# Altium schematic sheet Sheet1.SchDoc
size A; SheetNumber: 1; SheetTotal: 1
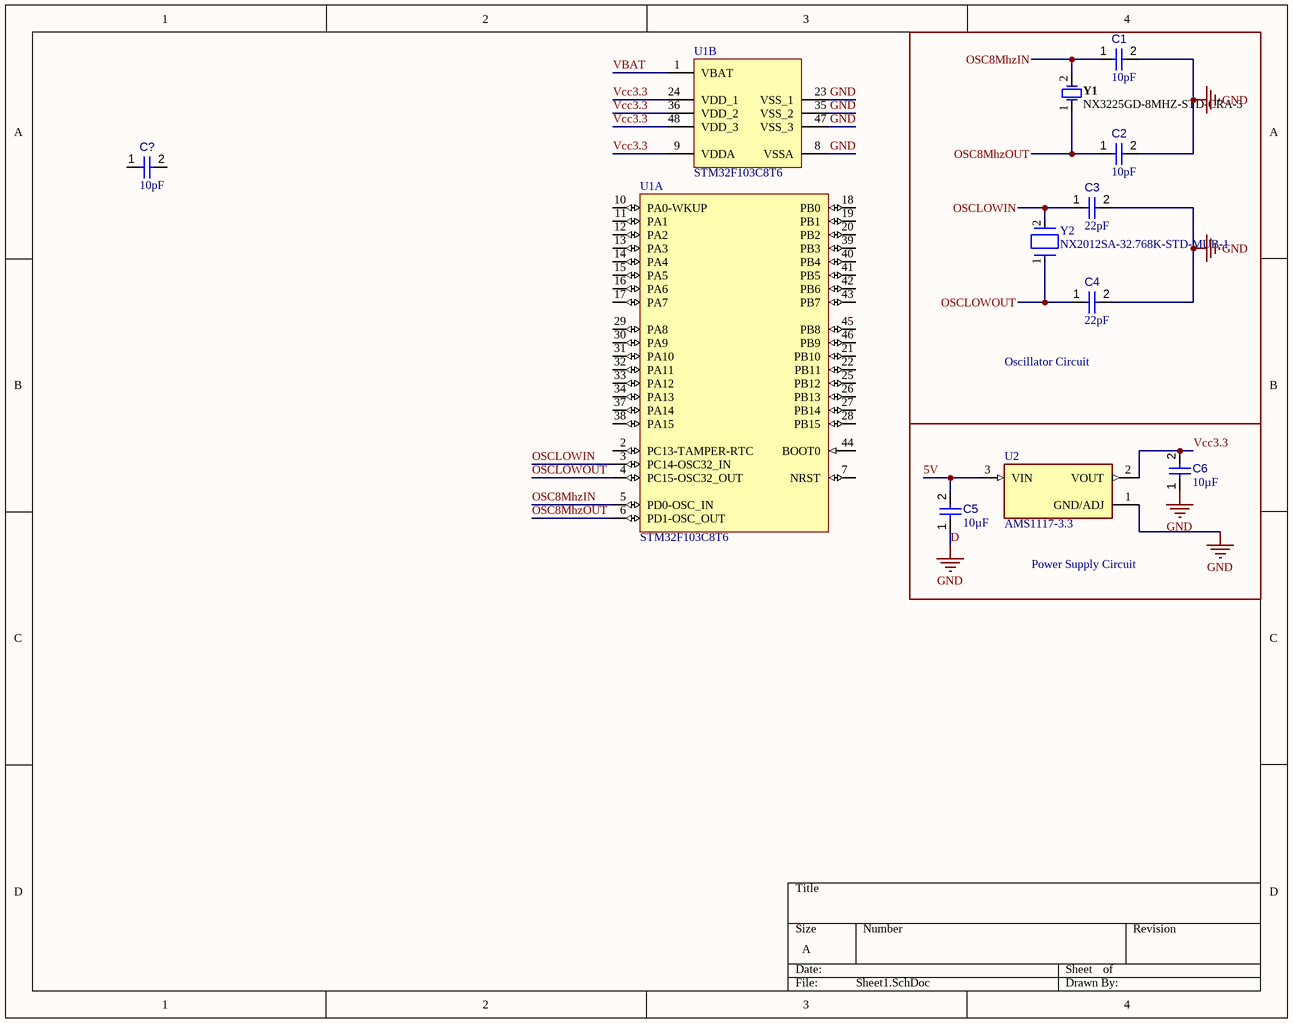
[diagram p0: Sheet1.SchDoc]

## Parts
C1  value 10pF  [CAPC1608X87X35NL15T15]  (hidden comment: Capacitor 10 pF +/- 0.25 pF 50 V 0603)
C2  value 10pF  [CAPC1608X87X35NL15T15]  (hidden comment: Capacitor 10 pF +/- 0.25 pF 50 V 0603)
C3  value 22pF  [CAPC0402(1005)60_L]  (hidden comment: Capacitor 22pF +/-10% 50V 0402)
C4  value 22pF  [CAPC0402(1005)60_L]  (hidden comment: Capacitor 22pF +/-10% 50V 0402)
C5  value 10µF  [CAPC0805(2012)145_L]  (hidden comment: Capacitor 10µF +/-20% 25V 0805)
C6  value 10µF  [CAPC0805(2012)145_L]  (hidden comment: Capacitor 10µF +/-20% 25V 0805)
C?  value 10pF  [CAPC1608X87X35NL15T15]  (hidden comment: Capacitor 10 pF +/- 0.25 pF 50 V 0603)
U1  STM32F103C8T6  [STM-LQFP48_L]  (parts A,B of 2)
U2  AMS1117-3.3  [SOT229P700X180-4N]
Y1  NX3225GD-8MHZ-STD-CRA-3  [NDK-NX3225GD-8MHZ-STD-CRA-3_V]
Y2  NX2012SA-32.768K-STD-MUB-1  [FP-NX2012SA-MFG]

## Blocks framed on the sheet
Oscillator Circuit: C1-C4 Y1 Y2
Power Supply Circuit: C5 C6 U2

## Nets
D: C1.2 C2.2 C3.2 C4.2 C5.1 C6.1 U1.8(VSSA) U1.23(VSS_1) U1.35(VSS_2) U1.47(VSS_3) U2.1(GND/ADJ)  [also labelled GND]
5V: C5.2 U2.3(VIN)
OSC8MhzIN: C1.1 U1.5(PD0-OSC_IN) Y1.2
OSC8MhzOUT: C2.1 U1.6(PD1-OSC_OUT) Y1.1
OSCLOWIN: C3.1 U1.3(PC14-OSC32_IN) Y2.2
OSCLOWOUT: C4.1 U1.4(PC15-OSC32_OUT) Y2.1
VBAT: U1.1(VBAT)
Vcc3.3: C6.2 U1.9(VDDA) U1.24(VDD_1) U1.36(VDD_2) U1.48(VDD_3) U2.2(VOUT)

Not connected (* = marked no-connect by the designer): C? 1 2; U1 2(PC13-TAMPER-RTC) 7(NRST) 10(PA0-WKUP) 11(PA1) 12(PA2) 13(PA3) 14(PA4) 15(PA5) 16(PA6) 17(PA7) 18(PB0) 19(PB1) 20(PB2) 21(PB10) 22(PB11) 25(PB12) 26(PB13) 27(PB14) 28(PB15) 29(PA8) 30(PA9) 31(PA10) 32(PA11) 33(PA12) 34(PA13) 37(PA14) 38(PA15) 39(PB3) 40(PB4) 41(PB5) 42(PB6) 43(PB7) 44(BOOT0) 45(PB8) 46(PB9)

## Library data of the parts
C1 C2 C? = CMP-001-00012-6: Chip Capacitor, 10 pF, +/- 0.25 pF, 50 V, 0603 (1608 Metric); Tolerance: 0.25%; Capacitor Type: Ceramic; Voltage Rating: 50V; Max Operating Temperature: 125°C; RoHS Compliant: True; Mounting Technology: SM; Pins: 2; Case/Package: 0603; Min Operating Temperature: -55°C
C3 C4 = CMP-001-00073-3: Chip Capacitor, 22pF +/-10%, 50V, 0402, Thickness 0.6 mm; Tolerance: 10%; Pins: 2; Voltage Rating: 50V; Max Operating Temperature: 85°C; Min Operating Temperature: -55°C; Mounting Technology: SMT; Case/Package: 0402
C5 C6 = CMP-001-00079-4: Chip Capacitor, 10µF +/-20%, 25V, 0805, Thickness 1.45 mm; Tolerance: 10%; Max Operating Temperature: 85°C; Case/Package: 0805; Voltage Rating: 25V; Min Operating Temperature: -55°C; Mounting Technology: SMT; Pins: 2
U1 = CMP-0237-00215-3: ARM Cortex-M3 32-bit MCU, 64 KB Flash, 20 KB Internal RAM, 37 I/Os, 48-pin LQFP, -40 to 85 degC, Tray; Supply Voltage(Vcc) min (V): 2; Internal RAM Size (kB): 20; FLASH Size (Prog) (kB): 64; A/D Converter: 2x12-bit (10 Channel); I/Os (High Current): 37; Operating Frequency(F) (Processor speed) (MHz): 72; Core: ARM Cortex-M3; ComponentLink3Description: Package Specification; Mounting Technology: Surface Mount; PartNumber: STM32F103C8T6; PackageReference: LQFP48; Packing: Tray; ComponentLink3URL: http://www.st.com/st-web-ui/static/active/en/resource/technical/document/datasheet/DM00058181.pdf; DatasheetVersion: Rev. 16; ComponentLink1URL: http://www.st.com/web/en/home.html; PackageVersion: Rev. 6, 06/2013; ComponentLink2URL: http://www.st.com/st-web-ui/static/active/en/resource/technical/document/datasheet/CD00161566.pdf; ComponentLink1Description: Manufacturer URL; ComponentLink2Description: Datasheet; PackageDescription: 48-Pin Low Profile Quad Flat Package, 7 x 7 mm Body, 0.5 mm Pitch
U2 = CMP-014-00002-1: Sot223/Pkg 1-Amp 3.3-Volt Low Drop Out Voltage Regulatator; MF: Advanced Monolithic Systems; Pins: 3; Check_prices: https://www.snapeda.com/parts/AMS1117-3.3/Advanced+Monolithic+Systems/view-part/?ref=eda; Design Item ID: AMS1117-3.3; Value: *; MP: AMS1117-3.3; Source: AMS1117-3.3.SchLib; Component Type: Standard; Case/Package: SOT-223 Seeed Technology; SnapEDA_Link: https://www.snapeda.com/parts/AMS1117-3.3/Advanced+Monolithic+Systems/view-part/?ref=snap
Y1 = CMP-2000-07595-1: Crystal Unit, 8 MHz, 8 pF, -40 to 150 degC, 2-Pin SMD, RoHS, Tape and Reel; Manufacturer: NDK; Load Capacitance: 8pF; ESR (Equivalent Series Resistance): 500Ohm; Frequency Tolerance: 50ppm; Frequency Stability: 150ppm; Frequency: 8MHz; Case/Package: SMD/SMT; Datasheet Version: 11/2016; Min Operating Temperature: -40degC; Packaging: TapeandReel; Width: 0.098inch; Package Quantity: 3000; Number of Pins: 2; Package Description: 2-Pin Surface Mount Device, Body 3.2 x 2.5 mm; RoHSCompliant: True; Package Reference: NX3225GD-8MHZ-STD-CRA-3; Datasheet URL: http://www.ndk.com/images/products/catalog/c_NX3225GD-STD-CRA-3_e.pdf; Mounting Technology: SurfaceMount; Length: 0.126inch; Mount: SurfaceMount; Manufacturer URL: http://www.ndk.com/en/; Max Operating Temperature: 150degC; Height: 0.039inch
Y2 = CMP-200220-000019-1: CRYSTAL 32.7680KHZ 12.5PF SMD; Frequency Tolerance: 20ppm; ESR (Equivalent Series Resistance): 80kR; Frequency: 32.768kHz; Mount: Surface Mount; Packaging: Cut Tape; Min Operating Temperature: -40°C; Max Operating Temperature: 85°C; Case/Package: SMD/SMT; RoHS Compliant: Yes; Length: 0.081inch; Series: NX2012SA; Height: 0.024inch; Width: 0.047inch; Load Capacitance: 12.5pF